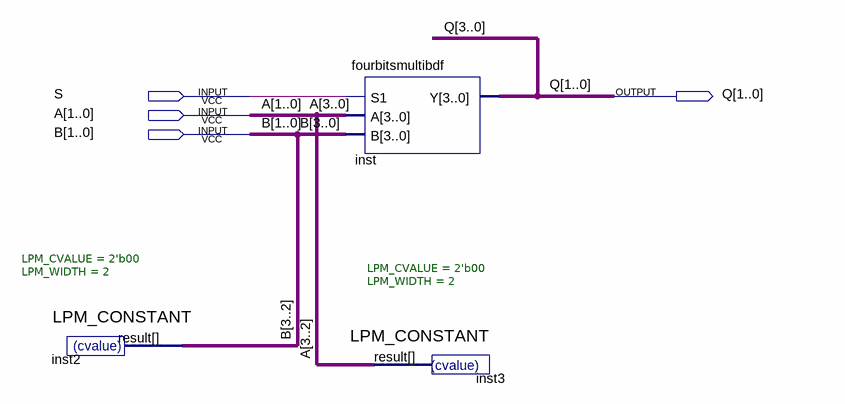
[diagram p0: schematic sheet]
// Quartus schematic twobitmulti.bdf as structural Verilog: 3 symbols, 4 pins
module twobitmulti (
  input  S,
  input  [3:0] A,
  input  [3:0] B,
  output [3:0] Q
);

  LPM_CONSTANT #(.LPM_CVALUE(2'b00), .LPM_WIDTH(2)) inst2 (.result(B[3:2]));
  fourbitsmultibdf inst (.S1(S), .A(A), .B(B), .Y(Q));
  LPM_CONSTANT #(.LPM_CVALUE(2'b00), .LPM_WIDTH(2)) inst3 (.result(A[3:2]));
endmodule
